# EAGLE design v2 (EAGLE 5.11)
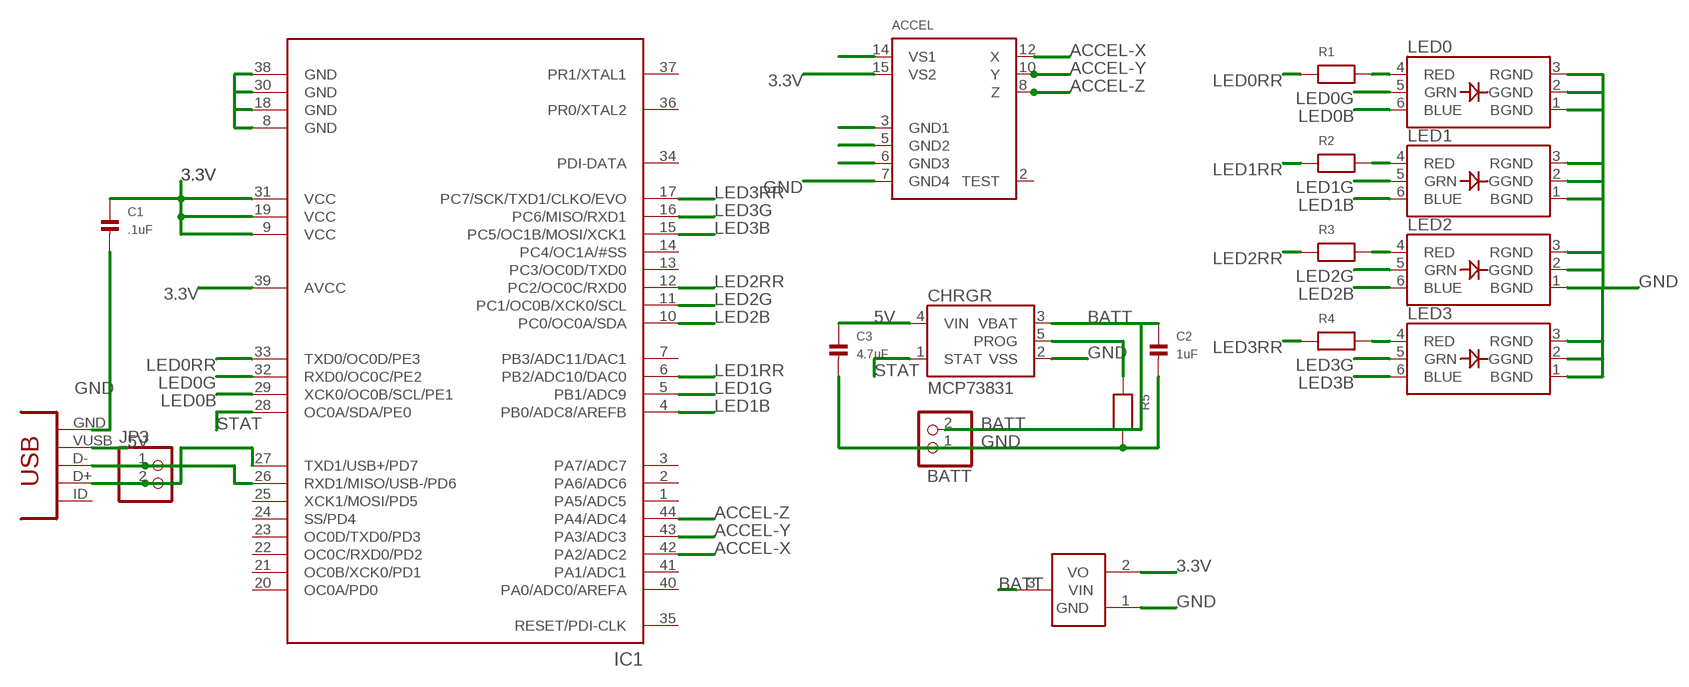
[diagram p0: schematic, sheet 1]

## Parts
3.3V  VREG  [SOT23-3]
ACCEL  ADXL3XX  [LFCSP-16]
BATT  HEADER-1X2ROUND  [1X02_ROUND]
C1  .1uF  CAP_CERAMIC0603  [0603]
C2  1uF  CAP_CERAMIC0603  [0603]
C3  4.7uF  CAP_CERAMIC0603  [0603]
CHRGR  MCP73831  [SOT23-5]
IC1  ATXMEGAXXA4U  [TQFP-44]
JP3  HEADER-1X2ROUND  [1X02_ROUND]
LED0  LED_RGB_PLCC6CREE-CLV6A  [RGBLED_PLCC6]
LED1  LED_RGB_PLCC6CREE-CLV6A  [RGBLED_PLCC6]
LED2  LED_RGB_PLCC6CREE-CLV6A  [RGBLED_PLCC6]
LED3  LED_RGB_PLCC6CREE-CLV6A  [RGBLED_PLCC6]
R1  RESISTOR0603  [0603]
R2  RESISTOR0603  [0603]
R3  RESISTOR0603  [0603]
R4  RESISTOR0603  [0603]
R5  RESISTOR0603  [0603]
USB1  USB-MINI-BUSB1  [CONN_USB_MINI-B]

## Nets
3.3V: 3.3V.2(VO) ACCEL.14(VS1) ACCEL.15(VS2) C1.1 IC1.9(VCC) IC1.19(VCC) IC1.31(VCC) IC1.39(AVCC)
5V: C3.1 CHRGR.4(VIN) USB1.VUSB
ACCEL-X: ACCEL.12(X) IC1.42(PA2/ADC2)
ACCEL-Y: ACCEL.10(Y) IC1.43(PA3/ADC3)
ACCEL-Z: ACCEL.8(Z) IC1.44(PA4/ADC4)
BATT: 3.3V.3(VIN) BATT.2 C2.1 CHRGR.3(VBAT)
D+: IC1.27(TXD1/USB+/PD7) JP3.2 USB1.D+
D-: IC1.26(RXD1/MISO/USB-/PD6) JP3.1 USB1.D-
GND: 3.3V.1(GND) ACCEL.3(GND1) ACCEL.5(GND2) ACCEL.6(GND3) ACCEL.7(GND4) BATT.1 C1.2 C2.2 C3.2 CHRGR.2(VSS) IC1.8(GND) IC1.18(GND) IC1.30(GND) IC1.38(GND) LED0.1(BGND) LED0.2(GGND) LED0.3(RGND) LED1.1(BGND) LED1.2(GGND) LED1.3(RGND) LED2.1(BGND) LED2.2(GGND) LED2.3(RGND) LED3.1(BGND) LED3.2(GGND) LED3.3(RGND) R5.2 USB1.GND
LED0B: IC1.29(XCK0/OC0B/SCL/PE1) LED0.6(BLUE)
LED0G: IC1.32(RXD0/OC0C/PE2) LED0.5(GRN)
LED0R: LED0.4(RED) R1.2
LED0RR: IC1.33(TXD0/OC0D/PE3) R1.1
LED1B: IC1.4(PB0/ADC8/AREFB) LED1.6(BLUE)
LED1G: IC1.5(PB1/ADC9) LED1.5(GRN)
LED1R: LED1.4(RED) R2.2
LED1RR: IC1.6(PB2/ADC10/DAC0) R2.1
LED2B: IC1.10(PC0/OC0A/SDA) LED2.6(BLUE)
LED2G: IC1.11(PC1/OC0B/XCK0/SCL) LED2.5(GRN)
LED2R: LED2.4(RED) R3.2
LED2RR: IC1.12(PC2/OC0C/RXD0) R3.1
LED3B: IC1.15(PC5/OC1B/MOSI/XCK1) LED3.6(BLUE)
LED3G: IC1.16(PC6/MISO/RXD1) LED3.5(GRN)
LED3R: LED3.4(RED) R4.2
LED3RR: IC1.17(PC7/SCK/TXD1/CLKO/EVO) R4.1
N$2: CHRGR.5(PROG) R5.1
STAT: CHRGR.1(STAT) IC1.28(OC0A/SDA/PE0)
Unconnected: ACCEL.2(TEST) IC1.1(PA5/ADC5) IC1.2(PA6/ADC6) IC1.3(PA7/ADC7) IC1.7(PB3/ADC11/DAC1) IC1.13(PC3/OC0D/TXD0) IC1.14(PC4/OC1A/#SS) IC1.20(OC0A/PD0) IC1.21(OC0B/XCK0/PD1) IC1.22(OC0C/RXD0/PD2) IC1.23(OC0D/TXD0/PD3) IC1.24(SS/PD4) IC1.25(XCK1/MOSI/PD5) IC1.34(PDI-DATA) IC1.35(RESET/PDI-CLK) IC1.36(PR0/XTAL2) IC1.37(PR1/XTAL1) IC1.40(PA0/ADC0/AREFA) IC1.41(PA1/ADC1) USB1.BODY@1(BODY) USB1.BODY@2(BODY) USB1.BODY@3(BODY) USB1.BODY@4(BODY) USB1.ID(USBID)

## Library data of the parts
3.3V = nonolith:VREG
ACCEL = nonolith:ADXL3XX: ADXL3XX Low-Power 3 Axis Accelerometer LFCSP16-R - 16 Pin LFCSP Package (Reflow footprint) LFSCP16-W - 16 Pin LFCSP Package (Wave footprint with extended pads for hand soldering)
BATT JP3 = nonolith:HEADER-1X2: PIN HEADER
C1-C3 = nonolith:CAP_CERAMIC: Ceramic Capacitors 0402 - 0402 Surface Mount Capacitors 0.1uF 10V 10% [Digikey: 490-1318-2-ND] 0603 - 0603 Surface Mount Capacitors 16 pF 50V 5% [Digikey: 445-5051-2-ND] 22 pF 50V [Digikey: PCC220ACVTR-ND] 33 pF 50V 5% [Digikey: 490-1415-1-ND] 56pF 50V 5% [Digikey: 490-1421-1-ND] 220pF 50V 5% [Digikey: 445-1285-1-ND] 680 pF 50V 2200 pF 50V 5% C0G [Digikey: 445-1297-1-ND] 5600 pF 100V 5% X7R [Digikey: 478-3711-1-ND] 0.1 µF 25V 10% [Digikey: PCC2277TR-ND] 0.22 µF 16V 10% X7R [Digikey: 445-1318-1-ND] 1.0 µF 25V 10% [Digikey: 445-5146-2-ND] 0603 - RF Specific 3pF 250V +/-0.1pF RF [Digikey: 712-1347-1-ND] 18 pF 250V 5% [Digikey: 478-3505-1-ND or 712-1322-1-ND] 56 pF 250V 5% C0G RF [Digikey: 490-4867-1-ND] 68 pF 250V RF [Digikey: 490-4868-1-ND] 0805 - 0805 Surface Mount Capacitors 220 pF 250V 2% RF Ceramic Capacitor [Digikey: 712-1398-1-ND] 1000 pF 50V 2% NP0 Ceramic Capacitor [Digikey: 478-3760-1-ND] 0.1 µF 25V 10% Ceramic Capacitor [Digikey: PCC1828TR-ND] 1.0 µF 16V 10% Ceramic Capacitor[Digikey: 490-1691-2-ND] 10.0 µF 10V 10% Ceramic Capacitor[Digikey: 709-1228-1-ND] 1206 - 1206 Surface Mount Capacitors
CHRGR = SparkFun:MCP73831: Microchip's MCP73831 Miniature single cell, fully integrated Li-Ion, Li-polymer charge management controller http://ww1.microchip.com/downloads/en/DeviceDoc/21984a.pdf
IC1 = nonolith:ATXMEGAXXA4U: ATXMEGA A4U Series (XMEGA+USB)
LED0 LED1-LED3 = microbuilder:LED_RGB_PLCC6: RGB LED Cree CLV6A-FKB - Digikey: CLV6A-FKB-CK1P1G1BB7R3R3TR-ND DC Foreward Current: 20mA Foreward Voltage: R = 2.0, G = 3.2, B = 3.2 Viewing Angle: 120°
R1-R5 = nonolith:RESISTOR: Resistors 0402 - 0402 Surface Mount Package 10.0K 1% 1/16W [Digikey: 311-10.0KLRTR-ND] 0603 - 0603 Surface Mount Package 0 Ohm 1/10 Watt 1% Resistor 15 Ohm 1/10 Watt 1% Resistor 33 Ohm 1/10 Watt 1% Resistor 49.9 Ohm 1/10 Watt 1% Resistor 100 Ohm 1/10 Watt 1% Resistor 150 Ohm 1/10 Watt 1% Resistor 240 Ohm 1/10 Watt 1% Resistor 390 Ohm 1/10 Watt 1% Resistor 560 Ohm 1/10 Watt 1% Resistor 750 Ohm 1/10 Watt 1% Resistor 1.0K Ohm 1/10 Watt 1% Resistor 1.5K Ohm 1/10 Watt 1% Resistor 2.0K Ohm 1/10 Watt 1% Resistor 4.7K Ohm 1/10 Watt 1% Resistor 10.0K Ohm 1/10 Watt 1% Resistor 20.0K Ohm 1/10 Watt 1% Resistor 33.0K Ohm 1/10 Watt 1% Resistor 100.0K Ohm 1/10 Watt 1% Resistor 0805 - 0805 Surface Mount Package 0 Ohm 1/8 Watt 1% Resistor 33 Ohm 1/8 Watt 1% Resistor 100 Ohm 1/8 Watt 1% Resistor 150 Ohm 1/8 Watt 1% Resistor 200 Ohm 1/8 Watt 1% Resistor 240 Ohm 1/8 Watt 1% Resistor 330 Ohm 1/8 Watt 1% Resistor 390 Ohm 1/8 Watt 1% Resistor 470 Ohm 1/8 Watt 1% Resistor 1.0K Ohm 1/8 Watt 1% Resistor 1.5K Ohm 1/8 Watt 1% Resistor 2.0K Ohm 1/8 Watt 1% Resistor 4.7K Ohm 1/8 Watt 1% Resistor 5.1K Ohm 1/8 Watt 1% Resistor 5.6K Ohm 1/8 Watt 1% Resistor 10.0K Ohm 1/8 Watt 1% Resistor 22.0K Ohm 1/8 Watt 1% Resistor 33.0K Ohm 1/8 Watt 1% Resistor 100K Ohm 1/8 Watt 1% Resistor 1206 - 1206 Surface Mount Package
USB1 = nonolith:USB-MINI-B: USB connector

## Net classes
0 default: width 0.254 mm, clearance 0.127 mm

## Board
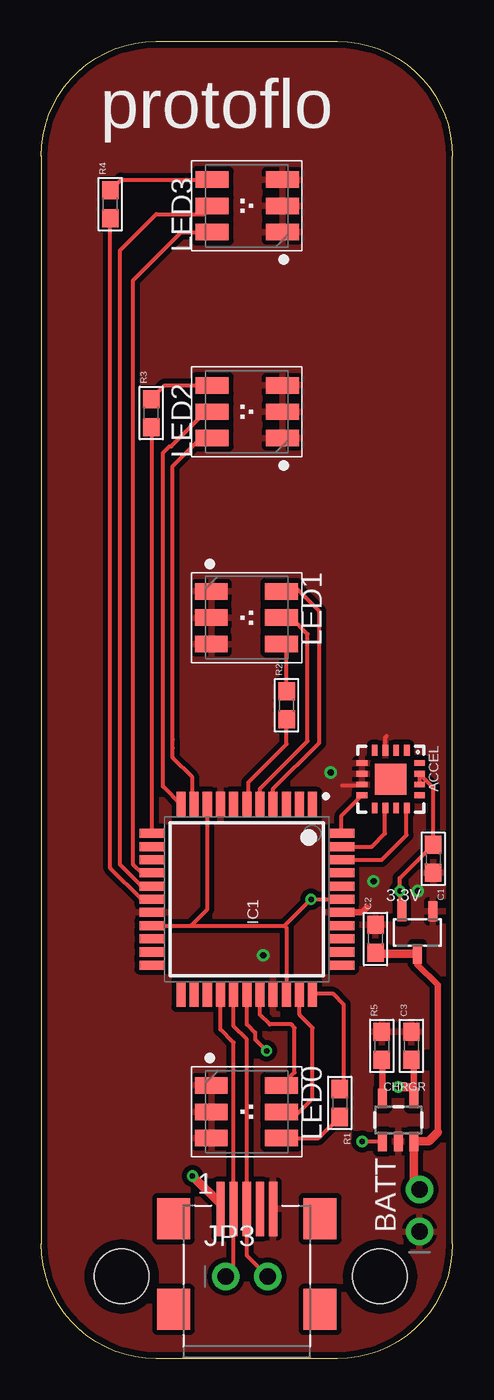
[diagram p1: board, top side]
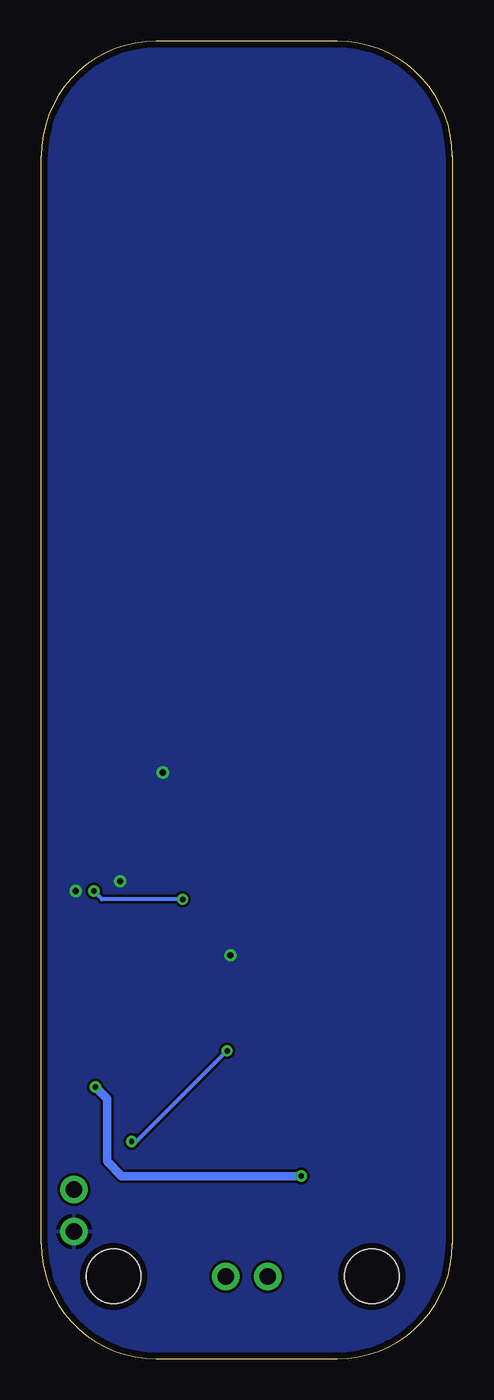
[diagram p2: board, bottom side, seen from below]

Size 25 x 80 mm. Coordinates in mm from the lower left corner, seen from the top.
Outline: 25,7 25,73 arc90 18,80 7,80 arc90 0,73 0,7 arc90 7,0 18,0 arc90 25,7
Copper layers (1*16): Top 0.0356mm / dielectric 1.5011mm / Bottom 0.0356mm
Design rules "LaenPCBOrder *": minimum track width 6mil, minimum drill 13mil, track to track 6mil, track to pad 6mil, pad to pad 6mil, via to via 6mil, smd to smd 6mil, copper to edge 15mil, drill to drill 6mil, minimum pad ring 7mil, minimum via ring 7mil, stop-mask expansion 4mil, vias tented up to drill 0mil, thermal gap 10mil

### Footprints (pad centres in the part's own frame; a part is rotated, then mirrored left to right if it is on the bottom)
SOT23-3 = smd 0.55 x 1.2: 1 0.95,1.3; 2 -0.95,1.3; 3 0,-1.3
LFCSP-16 = smd 1.9 x 1.9: 0 0,0 | smd 0.65 x 0.35: 1 -1.75,0.975; 2 -1.75,0.325; 3 -1.75,-0.325; 4 -1.75,-0.975; 9 1.75,-0.975; 10 1.75,-0.325; 11 1.75,0.325; 12 1.75,0.975 | smd 0.35 x 0.65: 5 -0.975,-1.75; 6 -0.325,-1.75; 7 0.325,-1.75; 8 0.975,-1.75; 13 0.975,1.75; 14 0.325,1.75; 15 -0.325,1.75; 16 -0.975,1.75
1X02_ROUND = drill 1 pad 1.676 round: 1 -1.27,0; 2 1.27,0
0603 = smd 1.1 x 1: 1 -0.85,0; 2 0.85,0
SOT23-5 = smd 0.55 x 1.2: 1 -0.95,-1.3; 2 0,-1.3; 3 0.95,-1.3; 4 0.95,1.3; 5 -0.95,1.3
TQFP-44 = smd 1.55 x 0.55: 1 -5.75,4; 2 -5.75,3.2; 3 -5.75,2.4; 4 -5.75,1.6; 5 -5.75,0.8; 6 -5.75,0; 7 -5.75,-0.8; 8 -5.75,-1.6; 9 -5.75,-2.4; 10 -5.75,-3.2; 11 -5.75,-4; 23 5.75,-4; 24 5.75,-3.2; 25 5.75,-2.4; 26 5.75,-1.6; 27 5.75,-0.8; 28 5.75,0; 29 5.75,0.8; 30 5.75,1.6; 31 5.75,2.4; 32 5.75,3.2; 33 5.75,4 | smd 0.55 x 1.55: 12 -4,-5.75; 13 -3.2,-5.75; 14 -2.4,-5.75; 15 -1.6,-5.75; 16 -0.8,-5.75; 17 0,-5.75; 18 0.8,-5.75; 19 1.6,-5.75; 20 2.4,-5.75; 21 3.2,-5.75; 22 4,-5.75; 34 4,5.75; 35 3.2,5.75; 36 2.4,5.75; 37 1.6,5.75; 38 0.8,5.75; 39 0,5.75; 40 -0.8,5.75; 41 -1.6,5.75; 42 -2.4,5.75; 43 -3.2,5.75; 44 -4,5.75
RGBLED_PLCC6 = smd 1 x 2: 1 -1.6,-2.158; 2 0,-2.158; 3 1.6,-2.158; 4 1.6,2.108; 5 0,2.108; 6 -1.6,2.108
STAND-OFF = hole 3.302: 0,0
CONN_USB_MINI-B = smd 2 x 2.5: BODY@1 -4.45,2.5; BODY@2 4.45,2.5; BODY@3 4.45,-3; BODY@4 -4.45,-3 | smd 0.5 x 3.3: D+ 0,3.1; D- -0.8,3.1; GND 1.6,3.1; ID 0.8,3.1; VUSB -1.6,3.1

### Placement (x,y rotation side)
3.3V  22.86,25.88 0 top
ACCEL  21.24,35.19 270 top
BATT  23,9 90 top
C1  23.83,30.36 270 top
C2  20.32,25.49 90 top
C3  22.5,19 90 top
CHRGR  21.7,14.5 0 top
IC1  12.5,27.9 270 top
JP3  12.5,5 0 top
LED0  12.5,15 270 top
LED1  12.5,45 270 top
LED2  12.5,57.5 90 top
LED3  12.5,70 90 top
R1  18.15,15.53 270 top
R2  14.92,39.68 90 top
R3  6.69,57.42 90 top
R4  4.2,70.1 90 top
R5  20.7,19 90 top
U$1  [STAND-OFF]  4.9,5 0 top
U$2  [STAND-OFF]  20.6,5 0 top
USB1  12.5,6 0 top

### Tracks (layer width: path | path; a pad name or v marks a point on that pad's centre or on a via)
3.3V  (via drill 0.33)
  Top 0.254: 3.3V.2 21.8,27.29 v21.8,28.4 21.8,29.18 C1.1 23.83,34.68 ACCEL.15 ACCEL.14 | IC1.39 v16.4,27.9 14.8,26.3 | 14.8,26.3 IC1.19 9.1,26.3 10.1,27.3 IC1.9 | 14.8,26.3 14.9,26.2 IC1.31
  Bottom 0.254: v21.8,28.4 21.3,27.9 v16.4,27.9
5V  (via drill 0.33)
  Top 0.406: CHRGR.4 22.65,16.4 22.65,17.92 C3.1
  Top 0.508: USB1.VUSB 10.9,9.4 v9.2,11.1 | v21.7,16.5 22.55,16.5 22.65,16.4
  Bottom 0.508: v9.2,11.1 20.1,11.1 21,12 21,15.8 v21.7,16.5
ACCEL-X
  Top 0.254: IC1.42 20.7,30.3 22.2,31.8 22.2,33.42 ACCEL.12
ACCEL-Y
  Top 0.254: IC1.43 20.1,31.1 20.9,31.9 20.9,33.42 ACCEL.10
ACCEL-Z
  Top 0.254: IC1.44 18.25,32.97 ACCEL.8
BATT
  Top 0.406: 3.3V.3 22.86,23.94 24.1,22.7 24.1,13.75
  Top 0.508: C2.1 20.38,24.58 3.3V.3 | 24.1,13.75 23.55,13.2 CHRGR.3 22.65,10.62 BATT.2
D+
  Top 0.254: IC1.27 11.7,20.2 12.5,19.4 USB1.D+ 12.5,6.27 JP3.2
D-
  Top 0.254: IC1.26 10.9,20 11.7,19.2 USB1.D- 11.7,5.47 JP3.1
GND  (via drill 0.38)
  Top 0.254: ACCEL.3 20.92,37.72 21,37.8 | ACCEL.7 19.43,34.8 18.3,34.8
  Top 0.406: IC1.38 19.5,27.1 19.8,27.4
  other vias: 20.2,29 13.5,24.5 17.6,35.6 22.9,28.4
  pour Top (isolate 0.305): -1,80 25,80 25,0 -1,0
  pour Bottom: -0.4,7.2 arc90 6.8,0 18.9,0 arc90 24.7,5.8 24.7,73.9 arc90 18.6,80 6.2,80 arc90 -0.4,73.4
LED0B
  Top 0.254: IC1.29 13.3,20.9 13.9,20.3 15.2,20.3 15.4,20.1 15.4,17.39 LED0.6
LED0G
  Top 0.254: IC1.32 15.7,20.9 16.5,20.1 16.5,15.8 15.6,14.9 14.71,14.9 LED0.5
LED0R
  Top 0.254: LED0.4 16.87,13.4 R1.2
LED0RR
  Top 0.254: IC1.33 17.75,22.15 18.4,21.5 18.4,16.63 R1.1
LED1B
  Top 0.254: IC1.4 14.1,34.6 16.9,37.4 16.9,45.4 15.6,46.7 14.71,46.7 LED1.6
LED1G
  Top 0.254: IC1.5 13.3,34.6 16.2,37.5 16.2,44 15.2,45 LED1.5
LED1R
  Top 0.254: R2.2 14.92,43.09 LED1.4
LED1RR
  Top 0.254: IC1.6 12.6,33.75 12.6,35 14.92,37.32 R2.1
LED2B
  Top 0.254: IC1.10 9.2,33.75 9.2,35.3 8,36.5 8,37.1 8,37.6 8,54.2 9.7,55.9 LED2.6
LED2G
  Top 0.254: LED2.5 10,57.5 7.9,55.4 7.8,55.4 7.4,55 7.4,34.75 IC1.11
LED2R
  Top 0.254: R3.2 7.52,59.1 LED2.4
LED2RR
  Top 0.254: IC1.12 6.75,56.51 R3.1
LED3B
  Top 0.254: LED3.6 8.5,68.4 5.6,65.5 5.6,30 6.1,29.5 IC1.15 6.65,29.4
LED3G
  Top 0.254: IC1.16 6.1,28.7 4.8,30 4.8,67.3 7,69.5 9.89,69.5 LED3.5
LED3R
  Top 0.254: R4.2 4.85,71.6 LED3.4
LED3RR
  Top 0.254: R4.1 4.2,29.8 6.1,27.9 IC1.17
N$2
  Top 0.406: CHRGR.5 20.75,18.1 R5.1
STAT  (via drill 0.33)
  Top 0.254: v19.5,13.2 CHRGR.1 | v19.5,13.2 | v13.7,18.7 13,19.4 13,19.8 12.5,20.3 IC1.28
  Bottom 0.254: v19.5,13.2 19.2,13.2 v13.7,18.7

### Text on the board
tNames: protoflo